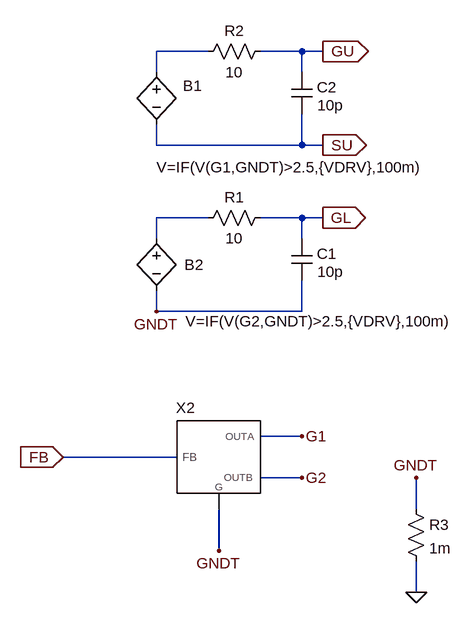
[diagram p0: schematic Generic_LLC_VM.asc]
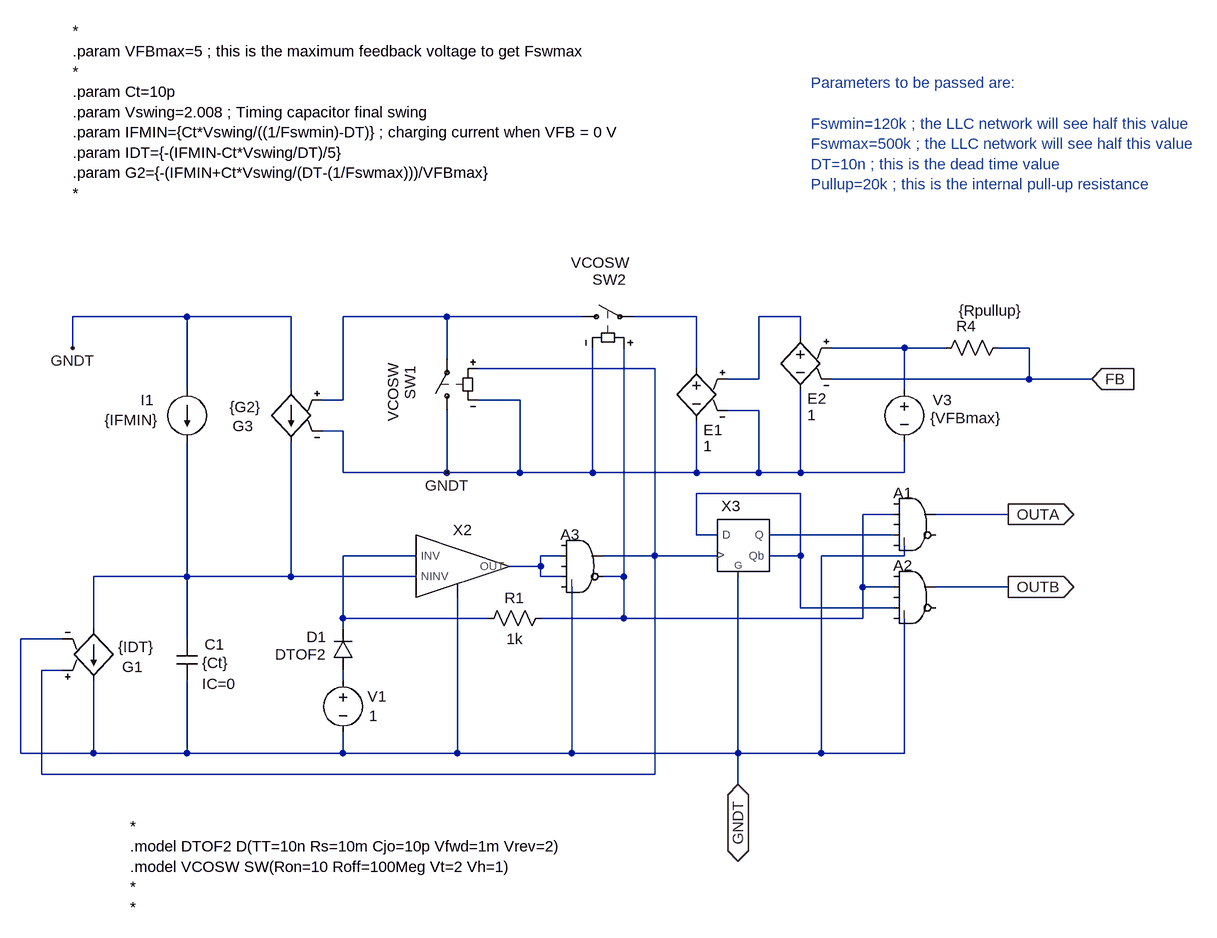
[diagram p1: sub-circuit vco_pulldown_subckt.asc]
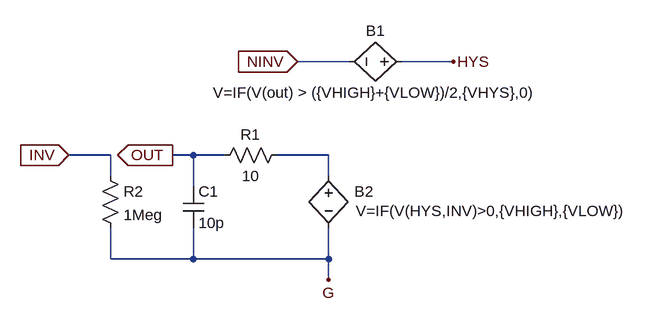
[diagram p2: sub-circuit comptof_g.asc]
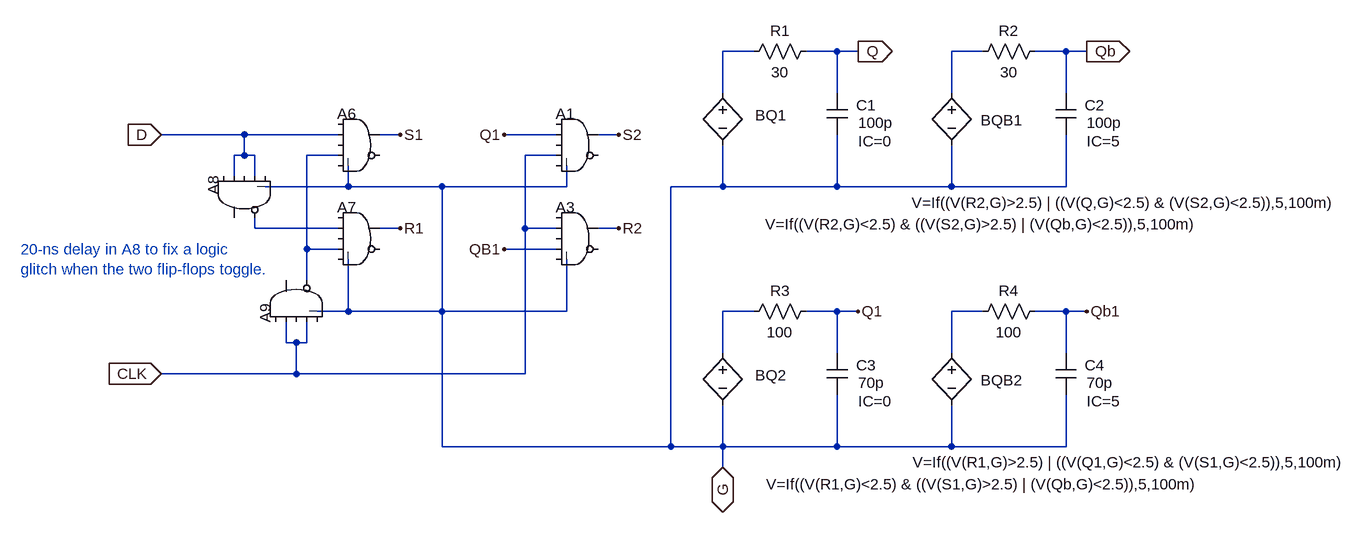
[diagram p3: sub-circuit d_flipflop_g.asc]
Generic_LLC_VM.asc, the LTspice schematic file:
Version 4.1
SHEET 1 880 680
WIRE 112 -448 32 -448
WIRE 256 -448 192 -448
WIRE 288 -448 256 -448
WIRE 32 -416 32 -448
WIRE 256 -416 256 -448
WIRE 32 -304 32 -336
WIRE 256 -304 256 -352
WIRE 256 -304 32 -304
WIRE 288 -304 256 -304
WIRE 112 -192 32 -192
WIRE 256 -192 192 -192
WIRE 288 -192 256 -192
WIRE 32 -160 32 -192
WIRE 256 -160 256 -192
WIRE 32 -48 32 -80
WIRE 256 -48 256 -96
WIRE 256 -48 32 -48
WIRE 256 144 192 144
WIRE 64 176 -112 176
WIRE 256 208 192 208
WIRE 432 256 432 208
WIRE 128 320 128 256
WIRE 432 384 432 336
FLAG -112 176 FB
IOPIN -112 176 In
FLAG 128 320 GNDT
FLAG 32 -48 GNDT
FLAG 288 -192 GL
IOPIN 288 -192 Out
FLAG 288 -448 GU
IOPIN 288 -448 Out
FLAG 288 -304 SU
IOPIN 288 -304 Out
FLAG 256 144 G1
FLAG 256 208 G2
FLAG 432 384 0
FLAG 432 208 GNDT
SYMBOL bv 32 -432 R0
WINDOW 0 41 37 Left 2
WINDOW 3 0 162 Left 2
SYMATTR InstName B1
SYMATTR Value V=IF(V(G1,GNDT)>2.5,{VDRV},100m)
SYMBOL bv 32 -176 R0
WINDOW 0 43 56 Left 2
WINDOW 3 45 143 Left 2
SYMATTR InstName B2
SYMATTR Value V=IF(V(G2,GNDT)>2.5,{VDRV},100m)
SYMBOL res 208 -208 R90
WINDOW 0 0 56 VBottom 2
WINDOW 3 32 56 VTop 2
SYMATTR InstName R1
SYMATTR Value 10
SYMBOL cap 240 -160 R0
WINDOW 0 39 23 Left 2
WINDOW 3 40 51 Left 2
SYMATTR InstName C1
SYMATTR Value 10p
SYMBOL res 208 -464 R90
WINDOW 0 0 56 VBottom 2
WINDOW 3 32 56 VTop 2
SYMATTR InstName R2
SYMATTR Value 10
SYMBOL cap 240 -416 R0
WINDOW 0 39 23 Left 2
WINDOW 3 40 51 Left 2
SYMATTR InstName C2
SYMATTR Value 10p
SYMBOL res 416 240 R0
SYMATTR InstName R3
SYMATTR Value 1m
SYMBOL TOF\\Subcircuits\\VCO_pulldown_subckt 128 176 R0
WINDOW 0 -51 -60 Bottom 2
SYMATTR InstName X2
SYMATTR SpiceLine Fswmin={Fswmin} Fswmax={Fswmax} Rpullup={Rpullup} DT={DT}

vco_pulldown_subckt.asc, the sub-circuit schematic file:
Version 4.1
SHEET 1 1284 752
WIRE -656 -160 -832 -160
WIRE -496 -160 -656 -160
WIRE -256 -160 -416 -160
WIRE -48 -160 -256 -160
WIRE 128 -160 32 -160
WIRE 288 -160 224 -160
WIRE 288 -128 288 -160
WIRE -832 -112 -832 -160
WIRE 448 -112 336 -112
WIRE 512 -112 448 -112
WIRE 640 -112 592 -112
WIRE -256 -96 -256 -160
WIRE 64 -80 -208 -80
WIRE 128 -80 128 -160
WIRE 224 -64 224 -160
WIRE 224 -64 176 -64
WIRE 640 -64 640 -112
WIRE 640 -64 336 -64
WIRE 736 -64 640 -64
WIRE -656 -48 -656 -160
WIRE -496 -48 -496 -160
WIRE 448 -48 448 -112
WIRE -416 -32 -416 -160
WIRE -416 -32 -448 -32
WIRE -144 -32 -208 -32
WIRE 224 -16 176 -16
WIRE -416 16 -448 16
WIRE -416 80 -416 16
WIRE -256 80 -256 -16
WIRE -256 80 -416 80
WIRE -144 80 -144 -32
WIRE -144 80 -256 80
WIRE -32 80 -32 -112
WIRE -32 80 -144 80
WIRE 128 80 128 0
WIRE 128 80 -32 80
WIRE 224 80 224 -16
WIRE 224 80 128 80
WIRE 288 80 288 -48
WIRE 288 80 224 80
WIRE 448 80 448 32
WIRE 448 80 288 80
WIRE 288 112 128 112
WIRE 432 144 384 144
WIRE 608 144 496 144
WIRE 128 176 128 112
WIRE 160 176 128 176
WIRE 432 176 240 176
WIRE -304 208 -416 208
WIRE -80 208 -112 208
WIRE 64 208 64 -80
WIRE 64 208 -16 208
WIRE 160 208 64 208
WIRE 288 208 288 112
WIRE 288 208 240 208
WIRE 448 208 448 192
WIRE 448 208 320 208
WIRE -112 224 -112 208
WIRE -112 224 -160 224
WIRE -656 240 -656 32
WIRE -656 240 -800 240
WIRE -496 240 -496 32
WIRE -496 240 -656 240
WIRE -304 240 -496 240
WIRE -112 240 -112 224
WIRE -80 240 -112 240
WIRE 16 240 16 -112
WIRE 16 240 -16 240
WIRE 384 256 384 144
WIRE 432 256 384 256
WIRE 608 256 496 256
WIRE 288 288 288 208
WIRE 432 288 288 288
WIRE -416 304 -416 208
WIRE -192 304 -416 304
WIRE 16 304 16 240
WIRE 16 304 -112 304
WIRE 384 304 384 256
WIRE 384 304 16 304
WIRE -800 320 -800 240
WIRE -416 320 -416 304
WIRE -848 336 -912 336
WIRE -656 336 -656 240
WIRE -848 384 -880 384
WIRE -416 400 -416 384
WIRE -912 512 -912 336
WIRE -800 512 -800 400
WIRE -800 512 -912 512
WIRE -656 512 -656 400
WIRE -656 512 -800 512
WIRE -416 512 -416 480
WIRE -416 512 -656 512
WIRE -240 512 -240 272
WIRE -240 512 -416 512
WIRE -64 512 -64 256
WIRE -64 512 -240 512
WIRE 192 512 192 240
WIRE 192 512 -64 512
WIRE 320 512 320 208
WIRE 320 512 192 512
WIRE 448 512 448 304
WIRE 448 512 320 512
WIRE -880 544 -880 384
WIRE 64 544 64 208
WIRE 64 544 -880 544
WIRE 192 560 192 512
FLAG 608 144 OUTA
IOPIN 608 144 Out
FLAG 608 256 OUTB
IOPIN 608 256 Out
FLAG 192 560 GNDT
IOPIN 192 560 BiDir
FLAG -832 -112 GNDT
FLAG -256 80 GNDT
FLAG 736 -64 FB
IOPIN 736 -64 In
SYMBOL Digital\\and 464 96 R0
WINDOW 0 -33 15 Left 2
SYMATTR InstName A1
SYMATTR SpiceLine Vhigh=5 Vlow=0 Ref=2.5
SYMBOL Digital\\and 464 208 R0
WINDOW 0 -33 15 Left 2
SYMATTR InstName A2
SYMATTR SpiceLine Vhigh=5 Vlow=0 Ref=2.5
SYMBOL Digital\\and -48 160 R0
WINDOW 0 -33 15 Left 2
SYMATTR InstName A3
SYMATTR SpiceLine Vhigh=5 Vlow=0 Ref=2.5
SYMBOL voltage -416 384 R0
WINDOW 0 38 40 Left 2
WINDOW 3 40 70 Left 2
SYMATTR InstName V1
SYMATTR Value 1
SYMBOL diode -400 384 R180
WINDOW 0 41 51 Left 2
WINDOW 3 41 24 Left 2
SYMATTR InstName D1
SYMATTR Value DTOF2
SYMBOL res -96 288 R90
WINDOW 0 0 56 VBottom 2
WINDOW 3 32 56 VTop 2
SYMATTR InstName R1
SYMATTR Value 1k
SYMBOL g -800 416 M180
WINDOW 0 44 37 Left 2
WINDOW 3 38 68 Left 2
SYMATTR InstName G1
SYMATTR Value {IDT}
SYMBOL cap -672 336 R0
WINDOW 0 43 8 Left 2
WINDOW 3 39 37 Left 2
WINDOW 39 39 69 Left 2
SYMATTR InstName C1
SYMATTR Value {Ct}
SYMATTR SpiceLine IC=0
SYMBOL current -656 -48 M0
WINDOW 0 51 16 Left 2
WINDOW 3 44 47 Left 2
SYMATTR InstName I1
SYMATTR Value {IFMIN}
SYMBOL sw -256 0 R180
WINDOW 3 83 89 VLeft 2
WINDOW 0 57 84 VLeft 2
SYMATTR Value VCOSW
SYMATTR InstName SW1
SYMBOL g2 -496 48 R180
WINDOW 0 58 40 Left 2
WINDOW 3 46 69 Left 2
SYMATTR InstName G3
SYMATTR Value {G2}
SYMBOL sw -64 -160 R270
WINDOW 3 83 89 VLeft 2
WINDOW 0 57 84 VLeft 2
SYMATTR Value VCOSW
SYMATTR InstName SW2
SYMBOL e 128 -96 M0
WINDOW 0 -40 110 Left 2
WINDOW 3 -24 135 Left 2
SYMATTR InstName E1
SYMATTR Value 1
SYMBOL e 288 -144 M0
WINDOW 0 -40 110 Left 2
WINDOW 3 -24 135 Left 2
SYMATTR InstName E2
SYMATTR Value 1
SYMBOL voltage 448 -64 R0
WINDOW 0 44 32 Left 2
WINDOW 3 40 60 Left 2
SYMATTR InstName V3
SYMATTR Value {VFBmax}
SYMBOL res 608 -128 R90
WINDOW 0 -2 65 VBottom 2
WINDOW 3 -57 27 VTop 2
SYMATTR InstName R4
SYMATTR Value {Rpullup}
SYMBOL TOF\\Subcircuits\\COMPTOF_G -240 224 R0
SYMATTR InstName X2
SYMATTR SpiceLine VHIGH=5 VLOW=1m VHYS=1u
SYMBOL TOF\\Subcircuits\\D_FlipFlop_G 192 192 R0
WINDOW 0 -11 -45 Bottom 2
SYMATTR InstName X3
TEXT -744 624 Left 2 !*\n.model DTOF2 D(TT=10n Rs=10m Cjo=10p Vfwd=1m Vrev=2)\n.model VCOSW SW(Ron=10 Roff=100Meg Vt=2 Vh=1)\n*\n*
TEXT -832 -600 Left 2 !*\n.param VFBmax=5 ; this is the maximum feedback voltage to get Fswmax\n*\n.param Ct=10p\n.param Vswing=2.008 ; Timing capacitor final swing\n.param IFMIN={Ct*Vswing/((1/Fswmin)-DT)} ; charging current when VFB = 0 V\n.param IDT={-(IFMIN-Ct*Vswing/DT)/5}\n.param G2={-(IFMIN+Ct*Vswing/(DT-(1/Fswmax)))/VFBmax}\n*
TEXT 304 -520 Left 2 ;Parameters to be passed are:\n \nFswmin=120k ; the LLC network will see half this value\nFswmax=500k ; the LLC network will see half this value\nDT=10n ; this is the dead time value\nPullup=20k ; this is the internal pull-up resistance

comptof_g.asc, the sub-circuit schematic file:
Version 4.1
SHEET 1 880 680
WIRE 64 192 -16 192
WIRE 224 192 144 192
WIRE -304 336 -368 336
WIRE -176 336 -208 336
WIRE -128 336 -176 336
WIRE 32 336 -48 336
WIRE -304 368 -304 336
WIRE 32 368 32 336
WIRE -176 384 -176 336
WIRE -304 496 -304 448
WIRE -176 496 -176 448
WIRE -176 496 -304 496
WIRE 32 496 32 448
WIRE 32 496 -176 496
WIRE 32 528 32 496
FLAG -16 192 NINV
IOPIN -16 192 In
FLAG 224 192 HYS
FLAG -208 336 OUT
IOPIN -208 336 Out
FLAG -368 336 INV
IOPIN -368 336 In
FLAG 32 528 G
SYMBOL bv 160 192 R90
WINDOW 0 -32 56 VBottom 2
WINDOW 3 32 56 VTop 2
SYMATTR InstName B1
SYMATTR Value V=IF(V(out) > ({VHIGH}+{VLOW})/2,{VHYS},0)
SYMBOL bv 32 352 R0
WINDOW 0 40 40 Left 2
WINDOW 3 42 70 Left 2
SYMATTR InstName B2
SYMATTR Value V=IF(V(HYS,INV)>0,{VHIGH},{VLOW})
SYMBOL res -32 320 R90
WINDOW 0 0 56 VBottom 2
WINDOW 3 32 56 VTop 2
SYMATTR InstName R1
SYMATTR Value 10
SYMBOL cap -192 384 R0
SYMATTR InstName C1
SYMATTR Value 10p
SYMBOL res -320 352 R0
SYMATTR InstName R2
SYMATTR Value 1Meg

d_flipflop_g.asc, the sub-circuit schematic file:
Version 4.1
SHEET 1 1820 1368
WIRE 768 448 720 448
WIRE 896 448 848 448
WIRE 928 448 896 448
WIRE 1120 448 1072 448
WIRE 1248 448 1200 448
WIRE 1280 448 1248 448
WIRE 720 512 720 448
WIRE 896 512 896 448
WIRE 1072 512 1072 448
WIRE 1248 512 1248 448
WIRE -16 576 -144 576
WIRE 128 576 -16 576
WIRE 224 576 192 576
WIRE 464 576 384 576
WIRE 560 576 528 576
WIRE -16 608 -16 576
WIRE -16 608 -32 608
WIRE 0 608 -16 608
WIRE 128 608 80 608
WIRE 464 608 416 608
WIRE -32 640 -32 608
WIRE 0 640 0 608
WIRE 144 656 144 624
WIRE 144 656 16 656
WIRE 288 656 144 656
WIRE 480 656 480 624
WIRE 480 656 288 656
WIRE 720 656 720 592
WIRE 720 656 640 656
WIRE 896 656 896 576
WIRE 896 656 720 656
WIRE 1072 656 1072 592
WIRE 1072 656 896 656
WIRE 1248 656 1248 576
WIRE 1248 656 1072 656
WIRE 0 720 0 704
WIRE 128 720 0 720
WIRE 224 720 192 720
WIRE 416 720 416 608
WIRE 464 720 416 720
WIRE 560 720 528 720
WIRE 80 752 80 608
WIRE 128 752 80 752
WIRE 464 752 384 752
WIRE 80 800 80 752
WIRE 144 848 144 768
WIRE 144 848 96 848
WIRE 288 848 288 656
WIRE 288 848 144 848
WIRE 480 848 480 768
WIRE 480 848 288 848
WIRE 768 848 720 848
WIRE 896 848 848 848
WIRE 928 848 896 848
WIRE 1120 848 1072 848
WIRE 1248 848 1200 848
WIRE 1280 848 1248 848
WIRE 48 896 48 864
WIRE 64 896 48 896
WIRE 80 896 80 864
WIRE 80 896 64 896
WIRE 720 912 720 848
WIRE 896 912 896 848
WIRE 1072 912 1072 848
WIRE 1248 912 1248 848
WIRE 64 944 64 896
WIRE 64 944 -144 944
WIRE 416 944 416 720
WIRE 416 944 64 944
WIRE 288 1056 288 848
WIRE 640 1056 640 656
WIRE 640 1056 288 1056
WIRE 720 1056 720 992
WIRE 720 1056 640 1056
WIRE 896 1056 896 976
WIRE 896 1056 720 1056
WIRE 1072 1056 1072 992
WIRE 1072 1056 896 1056
WIRE 1248 1056 1248 976
WIRE 1248 1056 1072 1056
WIRE 720 1088 720 1056
FLAG -144 576 D
IOPIN -144 576 In
FLAG -144 944 CLK
IOPIN -144 944 In
FLAG 560 576 S2
FLAG 560 720 R2
FLAG 928 448 Q
IOPIN 928 448 Out
FLAG 1280 448 Qb
IOPIN 1280 448 Out
FLAG 224 576 S1
FLAG 224 720 R1
FLAG 384 576 Q1
FLAG 384 752 QB1
FLAG 928 848 Q1
FLAG 1280 848 Qb1
FLAG 720 1088 G
IOPIN 720 1088 BiDir
SYMBOL Digital\\and 496 528 R0
WINDOW 0 -33 16 Left 2
SYMATTR InstName A1
SYMATTR SpiceLine Vhigh=5 Vlow=100m Ref=2.5
SYMBOL Digital\\and 496 672 R0
WINDOW 0 -33 16 Left 2
SYMATTR InstName A3
SYMATTR SpiceLine Vhigh=5 Vlow=100m Ref=2.5
SYMBOL Digital\\and 160 528 R0
WINDOW 0 -33 16 Left 2
SYMATTR InstName A6
SYMATTR SpiceLine Vhigh=5 Vlow=100m Ref=2.5
SYMBOL Digital\\and 160 672 R0
WINDOW 0 -33 16 Left 2
SYMATTR InstName A7
SYMATTR SpiceLine Vhigh=5 Vlow=100m Ref=2.5
SYMBOL Digital\\and -80 672 M90
WINDOW 0 -33 16 Left 2
SYMATTR InstName A8
SYMATTR SpiceLine Vhigh=5 Vlow=100m Ref=2.5 Td=20n
SYMBOL Digital\\and 0 832 R270
WINDOW 0 -33 16 Left 2
SYMATTR InstName A9
SYMATTR SpiceLine Vhigh=5 Vlow=100m Ref=2.5
SYMBOL bv 720 496 R0
WINDOW 0 50 50 Left 2
WINDOW 3 65 218 Left 2
SYMATTR InstName BQ1
SYMATTR Value V=If((V(R2,G)<2.5) & ((V(S2,G)>2.5) | (V(Qb,G)<2.5)),5,100m)
SYMBOL res 864 432 R90
WINDOW 0 0 56 VBottom 2
WINDOW 3 32 56 VTop 2
SYMATTR InstName R1
SYMATTR Value 30
SYMBOL cap 880 512 R0
WINDOW 0 45 19 Left 2
WINDOW 3 48 46 Left 2
WINDOW 123 48 74 Left 2
SYMATTR InstName C1
SYMATTR Value 100p
SYMATTR Value2 IC=0
SYMBOL bv 1072 496 R0
WINDOW 0 45 58 Left 2
WINDOW 3 -61 185 Left 2
SYMATTR InstName BQB1
SYMATTR Value V=If((V(R2,G)>2.5) | ((V(Q,G)<2.5) & (V(S2,G)<2.5)),5,100m)
SYMBOL res 1216 432 R90
WINDOW 0 0 56 VBottom 2
WINDOW 3 32 56 VTop 2
SYMATTR InstName R2
SYMATTR Value 30
SYMBOL cap 1232 512 R0
WINDOW 0 45 19 Left 2
WINDOW 3 48 46 Left 2
WINDOW 123 48 74 Left 2
SYMATTR InstName C2
SYMATTR Value 100p
SYMATTR Value2 IC=5
SYMBOL bv 720 896 R0
WINDOW 0 50 50 Left 2
WINDOW 3 67 218 Left 2
SYMATTR InstName BQ2
SYMATTR Value V=If((V(R1,G)<2.5) & ((V(S1,G)>2.5) | (V(Qb,G)<2.5)),5,100m)
SYMBOL res 864 832 R90
WINDOW 0 0 56 VBottom 2
WINDOW 3 32 56 VTop 2
SYMATTR InstName R3
SYMATTR Value 100
SYMBOL cap 880 912 R0
WINDOW 0 45 19 Left 2
WINDOW 3 48 46 Left 2
WINDOW 123 48 74 Left 2
SYMATTR InstName C3
SYMATTR Value 70p
SYMATTR Value2 IC=0
SYMBOL bv 1072 896 R0
WINDOW 0 45 58 Left 2
WINDOW 3 -60 184 Left 2
SYMATTR InstName BQB2
SYMATTR Value V=If((V(R1,G)>2.5) | ((V(Q1,G)<2.5) & (V(S1,G)<2.5)),5,100m)
SYMBOL res 1216 832 R90
WINDOW 0 0 56 VBottom 2
WINDOW 3 32 56 VTop 2
SYMATTR InstName R4
SYMATTR Value 100
SYMBOL cap 1232 912 R0
WINDOW 0 45 19 Left 2
WINDOW 3 48 46 Left 2
WINDOW 123 48 74 Left 2
SYMATTR InstName C4
SYMATTR Value 70p
SYMATTR Value2 IC=5
TEXT -360 752 Left 2 ;20-ns delay in A8 to fix a logic \nglitch when the two flip-flops toggle.

The netlist it stands for:
* Generic_LLC_VM.asc
B1 N001 SU V=IF(V(G1,GNDT)>2.5,{VDRV},100m)
B2 N002 GNDT V=IF(V(G2,GNDT)>2.5,{VDRV},100m)
R1 GL N002 10
C1 GL GNDT 10p
R2 GU N001 10
C2 GU SU 10p
R3 GNDT 0 1m
X§X2 FB GNDT G1 G2 vco_pulldown_subckt params: Fswmin={Fswmin} Fswmax={Fswmax} Rpullup={Rpullup} DT={DT}

* block symbol definitions
.subckt vco_pulldown_subckt FB GNDT OUTA OUTB
A1 GNDT N007 GNDT N008 GNDT GNDT OUTA GNDT AND Vhigh=5 Vlow=0 Ref=2.5
A2 GNDT N007 GNDT N006 GNDT GNDT OUTB GNDT AND Vhigh=5 Vlow=0 Ref=2.5
A3 GNDT N010 GNDT N010 GNDT N007 N005 GNDT AND Vhigh=5 Vlow=0 Ref=2.5
V1 N012 GNDT 1
D1 N012 N009 DTOF2
R1 N007 N009 1k
G1 N011 GNDT N005 GNDT {IDT}
C1 N011 GNDT {Ct} IC=0
I1 GNDT N011 {IFMIN}
SW1 GNDT N001 N005 GNDT VCOSW
G3 GNDT N011 N001 GNDT {G2}
SW2 N001 N002 N007 GNDT VCOSW
E1 N002 GNDT N003 GNDT 1
E2 N003 GNDT N004 FB 1
V3 N004 GNDT {VFBmax}
R4 FB N004 {Rpullup}
X§X2 N009 N011 N010 GNDT comptof_g params: VHIGH=5 VLOW=1m VHYS=1u
X§X3 N006 N005 N008 N006 GNDT d_flipflop_g
*
.model DTOF2 D(TT=10n Rs=10m Cjo=10p Vfwd=1m Vrev=2)
.model VCOSW SW(Ron=10 Roff=100Meg Vt=2 Vh=1)
*
*
*
.param VFBmax=5 ; this is the maximum feedback voltage to get Fswmax
*
.param Ct=10p
.param Vswing=2.008 ; Timing capacitor final swing
.param IFMIN={Ct*Vswing/((1/Fswmin)-DT)} ; charging current when VFB = 0 V
.param IDT={-(IFMIN-Ct*Vswing/DT)/5}
.param G2={-(IFMIN+Ct*Vswing/(DT-(1/Fswmax)))/VFBmax}
*
* Parameters to be passed are:
* Fswmin=120k ; the LLC network will see half this value
* Fswmax=500k ; the LLC network will see half this value
* DT=10n ; this is the dead time value
* Pullup=20k ; this is the internal pull-up resistance
.ends vco_pulldown_subckt

.subckt comptof_g INV NINV OUT G
B1 HYS NINV V=IF(V(out) > ({VHIGH}+{VLOW})/2,{VHYS},0)
B2 N001 G V=IF(V(HYS,INV)>0,{VHIGH},{VLOW})
R1 N001 OUT 10
C1 OUT G 10p
R2 INV G 1Meg
.ends comptof_g

.subckt d_flipflop_g D CLK Q Qb G
A1 G Q1 G CLK G G S2 G AND Vhigh=5 Vlow=100m Ref=2.5
A3 G CLK G QB1 G G R2 G AND Vhigh=5 Vlow=100m Ref=2.5
A6 G D G N003 G G S1 G AND Vhigh=5 Vlow=100m Ref=2.5
A7 G N004 G N003 G G R1 G AND Vhigh=5 Vlow=100m Ref=2.5
A8 G D G D G N004 G G AND Vhigh=5 Vlow=100m Ref=2.5 Td=20n
A9 G CLK G CLK G N003 G G AND Vhigh=5 Vlow=100m Ref=2.5
BQ1 N001 G V=If((V(R2,G)<2.5) & ((V(S2,G)>2.5) | (V(Qb,G)<2.5)),5,100m)
R1 Q N001 30
C1 Q G 100p IC=0
BQB1 N002 G V=If((V(R2,G)>2.5) | ((V(Q,G)<2.5) & (V(S2,G)<2.5)),5,100m)
R2 Qb N002 30
C2 Qb G 100p IC=5
BQ2 N005 G V=If((V(R1,G)<2.5) & ((V(S1,G)>2.5) | (V(Qb,G)<2.5)),5,100m)
R3 Q1 N005 100
C3 Q1 G 70p IC=0
BQB2 N006 G V=If((V(R1,G)>2.5) | ((V(Q1,G)<2.5) & (V(S1,G)<2.5)),5,100m)
R4 QB1 N006 100
C4 QB1 G 70p IC=5
* 20-ns delay in A8 to fix a logic
* glitch when the two flip-flops toggle.
.ends d_flipflop_g

.model D D
.lib standard.dio
.backanno
.end